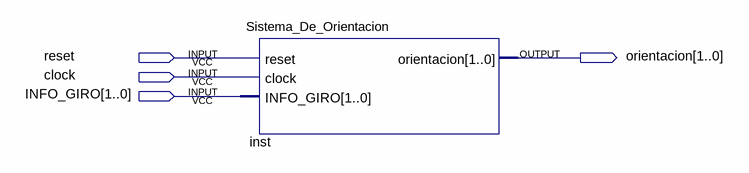
[diagram p0: schematic sheet]
// Quartus schematic prueba_orientacion.bdf as structural Verilog: 1 symbols, 4 pins
module prueba_orientacion (
  input  reset,
  input  clock,
  input  [1:0] INFO_GIRO,
  output [1:0] orientacion
);

  Sistema_De_Orientacion inst (.reset(reset), .clock(clock), .INFO_GIRO(INFO_GIRO), .orientacion(orientacion));
endmodule
